# EasyEDA schematic SCH_Tanbre_v2_2026-05-30_new.json
TITLE: Tanbre; REV: 2.0; Date: 2026-05-30; Sheet: 1/1; Company: Student
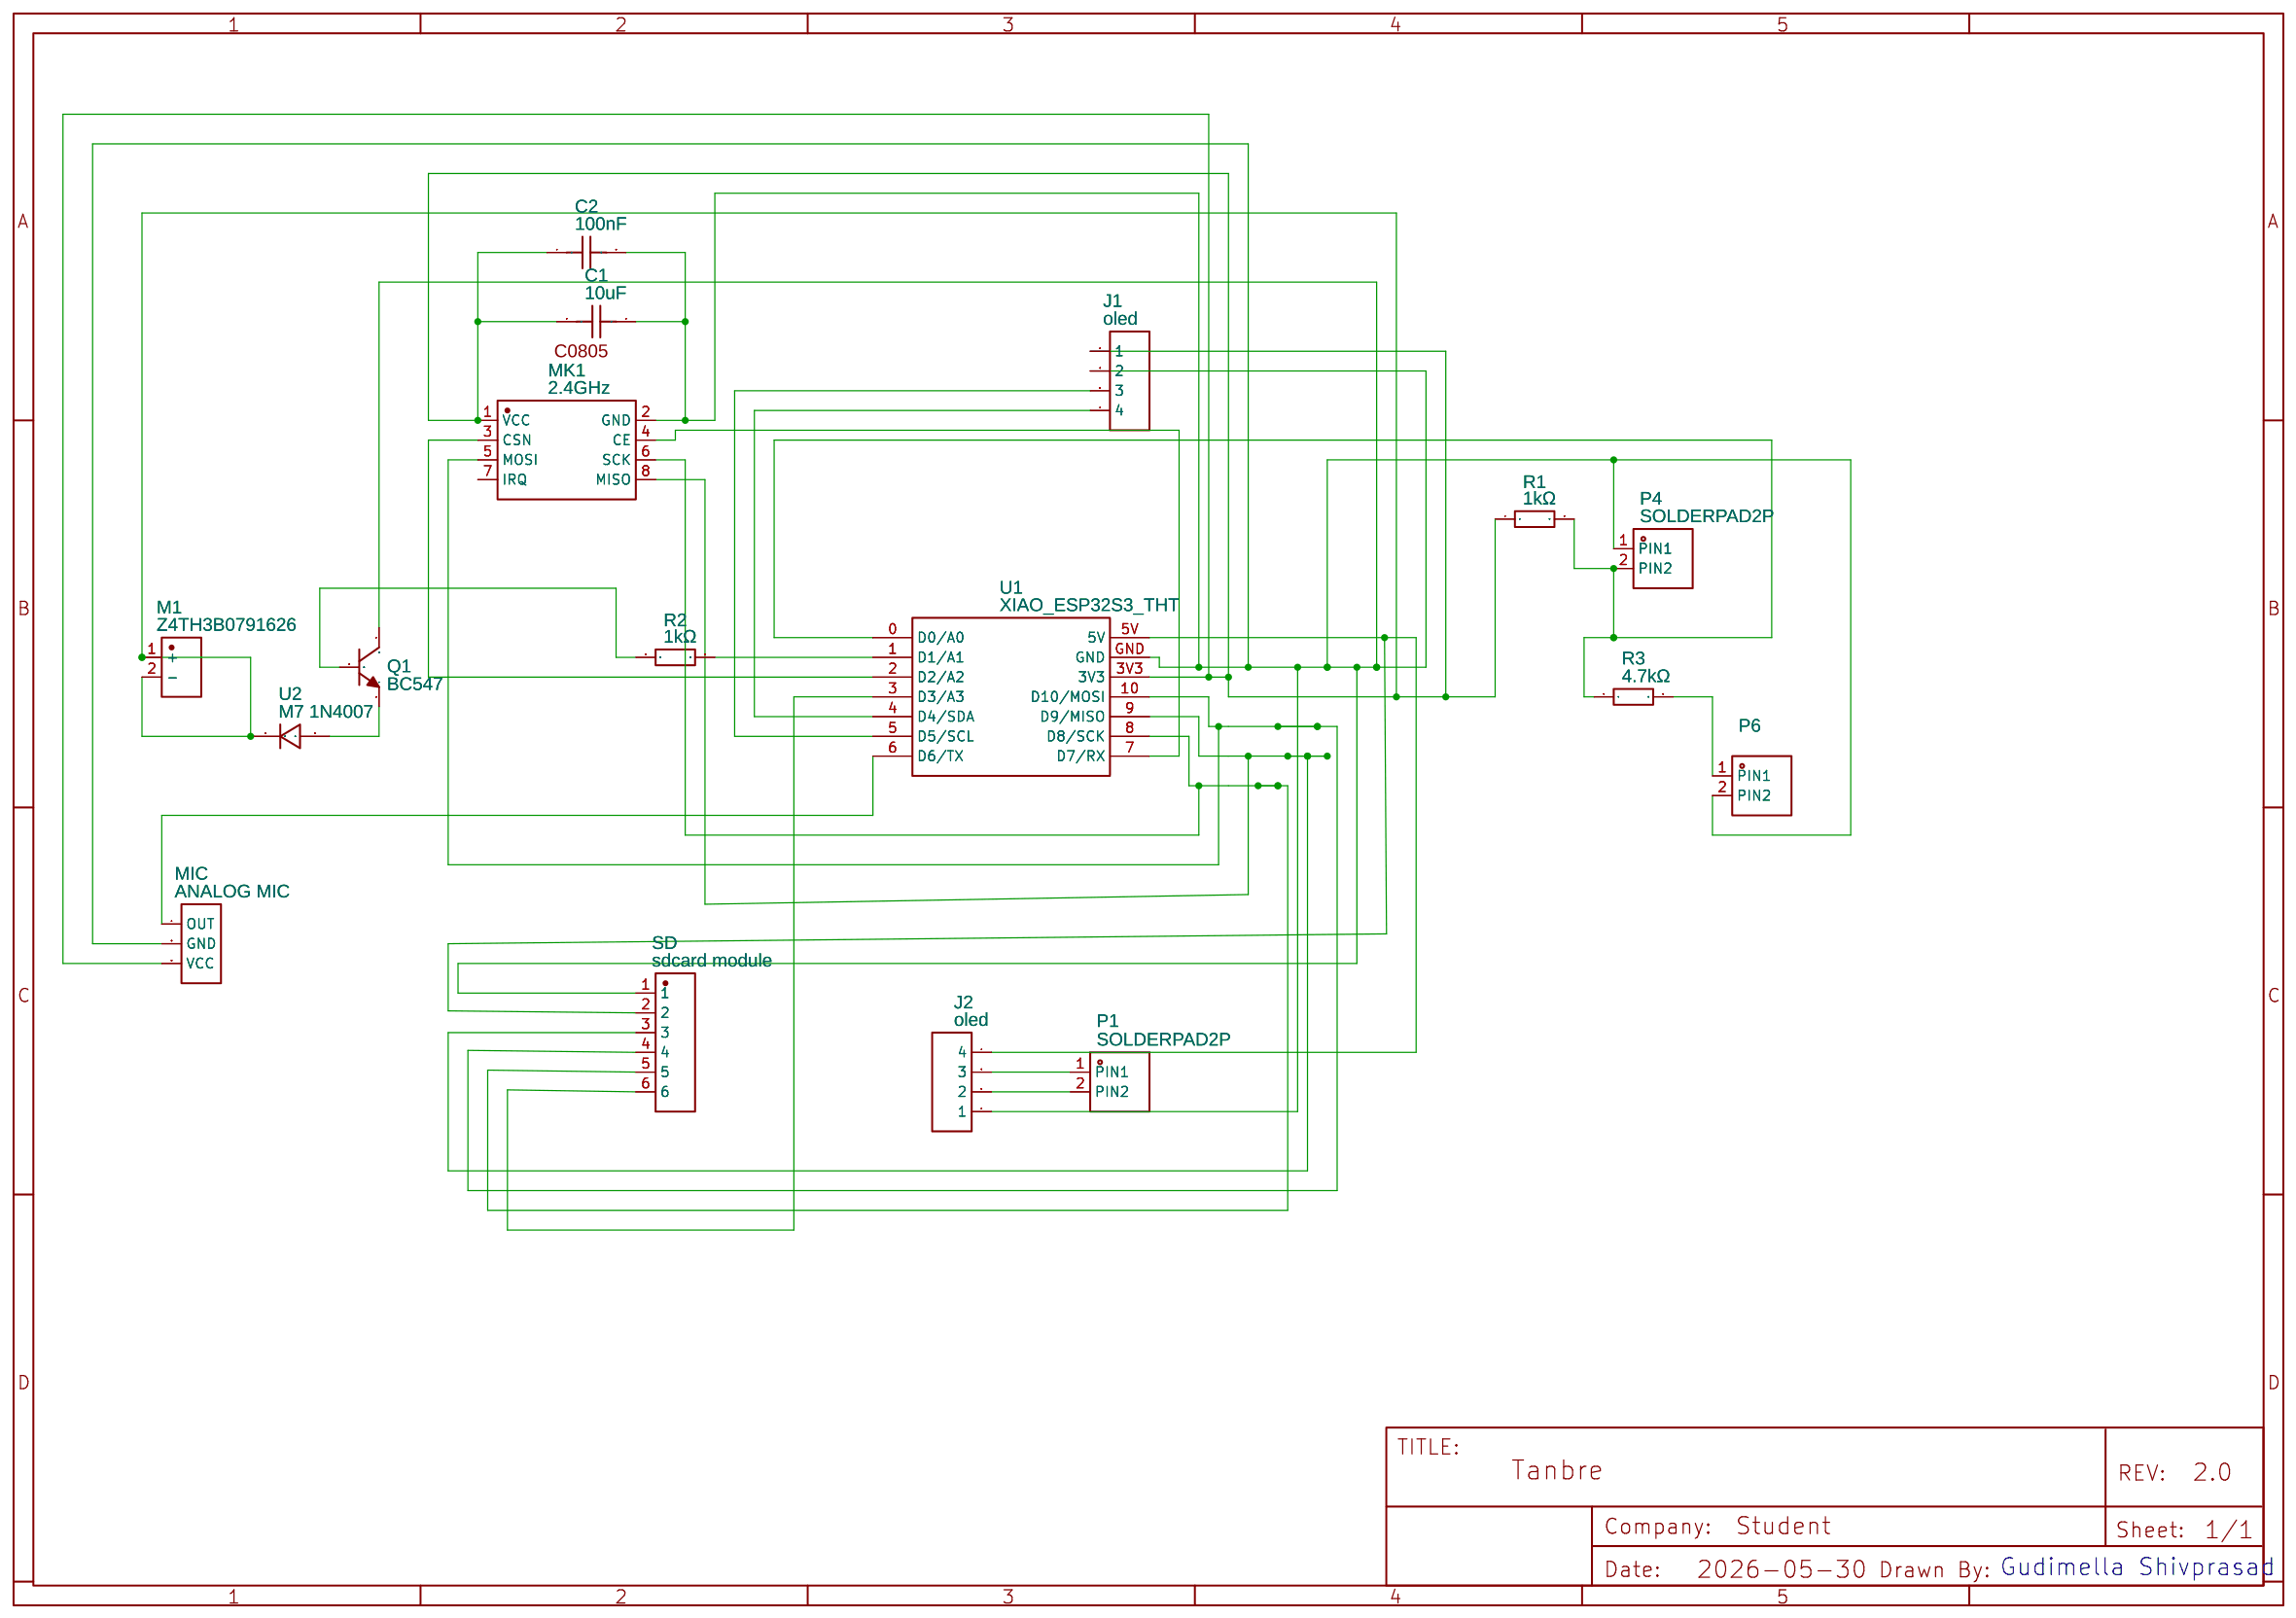
[diagram p0: schematic sheet]

## Parts
C1  10uF  [C0805]
C2  100nF  [C0805]
J1  oled  [HDR-M-2.54_1X4]
J2  oled  [HDR-M-2.54_1X4]
M1  Z4TH3B0791626  [MOTOR-SMD_Z4TH3B0791626]
MIC  ANALOG MIC  [HDR-M-2.54_1X3]
MK1  2.4GHz  [WIRELM-SMD_L28.6-W15.3-P2.54_NRF24L01]
P1  SOLDERPAD2P  [SOLDERPAD-BIG-2X1-2.54MM]
P4  SOLDERPAD2P  [SOLDERPAD-BIG-2X1-2.54MM]
P6  SOLDERPAD2P  [SOLDERPAD-BIG-2X1-2.54MM]
Q1  BC547  [TO-92-3_L4.5-W3.5-P1.27-L]
R1  1kΩ  [R0402]
R2  1kΩ  [R0402]
R3  4.7kΩ  [R1206]
SD  sdcard module  [HDR-TH_HC-PM254-5.0H-1X6PZ]
U1  XIAO_ESP32S3_THT  [XIAO_ESP32S3_THT]
U2  M7 1N4007  [SMA_L4.4-W2.8-LS5.4-RD]

## Library data of the parts
C1 = V106K0805X5R250NHP: Contributor: lcsc; Supplier: LCSC; Supplier Part: C5240379; Manufacturer: VIIYONG(微容); JLCPCB Part Class: Extended Part; Package Display: Yes
C2 = VJ0805Y104KXXCW1BC: Supplier: LCSC; Supplier Part: C2169829; Manufacturer: VISHAY(威世); JLCPCB Part Class: Extended Part; Contributor: lcsc
J1 J2 = HDR-M-2.54_1x4: Supplier Part: C124378; Supplier: LCSC; Contributor: arnotang
M1 = Z4TH3B0791626: Supplier: LCSC; Supplier Part: C2836756; Manufacturer: KOTL(金龙机电); JLCPCB Part Class: Extended Part; Contributor: lcsc
MIC = HDR-M-2.54_1x3: Supplier Part: C124375; Supplier: LCSC; Contributor: arnotang
MK1 = NRF24L01: Supplier: LCSC; Manufacturer: Ai-Thinker(安信可); Manufacturer Part: NF-04; Supplier Part: C90751; JLCPCB Part Class: Extended Part
P1 P4 P6 = SOLDERPAD2P: Manufacturer Part: New SchematicLib; Contributor: bszabo
Q1 = BC547: Contributor: LCSC; Supplier: LCSC; Supplier Part: C2910381; Manufacturer: CJ(江苏长电/长晶); Manufacturer Part: BC547(RANGE:420-800); JLCPCB Part Class: Extended Part
R1 R2 = CR-02JL6----1K: Contributor: LCSC; Supplier: LCSC; Supplier Part: C279987; Manufacturer: Viking(光颉); JLCPCB Part Class: Extended Part
R3 = RMC12064.7K5%N: Contributor: LCSC; Supplier: LCSC; Supplier Part: C269760; Manufacturer: Tyohm(幸亚电阻); JLCPCB Part Class: Extended Part
SD = HC-PM254-5.0H-1X6PZ: Supplier: LCSC; Supplier Part: C27985231; Manufacturer: HC(虹成电子); Manufacturer Part: HC-PM254-5.0H-1x6PZ; JLCPCB Part Class: Extended Part; Contributor: lcsc
U1 = XIAO_ESP32S3_THT: Contributor: maeldefoy
U2 = M7 1N4007: Contributor: lcsc; Supplier: LCSC; Supplier Part: C5337558; Manufacturer: JUXING(钜兴); JLCPCB Part Class: Extended Part

## Nets
Net-(C1-1): C1.1 C2.1 J1.1 M1.1(+) M1.2(-) MIC.3(VCC) MK1.1(VCC) R1.1 U1.3V3 U2.1
Net-(C1-2): C1.2 C2.2 J1.2 J2.1 MIC.2(GND) MK1.2(GND) P4.1(PIN1) P6.2(PIN2) Q1.1(C) SD.1 U1.GND
Net-(J1-3): J1.3 U1.5(D5/SCL)
Net-(J1-4): J1.4 U1.4(D4/SDA)
Net-(J2-2): J2.2 P1.2(PIN2)
Net-(J2-3): J2.3 P1.1(PIN1)
Net-(J2-4): J2.4 SD.2 U1.5V
Net-(MIC-1): MIC.1(OUT) U1.6(D6/TX)
Net-(MK1-3): MK1.3(CSN) U1.2(D2/A2)
Net-(MK1-4): MK1.4(CE) U1.7(D7/RX)
Net-(MK1-5): MK1.5(MOSI) SD.4 U1.10(D10/MOSI)
Net-(MK1-6): MK1.6(SCK) SD.5 U1.8(D8/SCK)
Net-(MK1-8): MK1.8(MISO) SD.3 U1.9(D9/MISO)
Net-(P4-2): P4.2(PIN2) R1.2 R3.1 U1.0(D0/A0)
Net-(P6-1): P6.1(PIN1) R3.2
Net-(Q1-2): Q1.2(B) R2.1
Net-(Q1-3): Q1.3(E) U2.2
Net-(R2-2): R2.2 U1.1(D1/A1)
Net-(SD-6): SD.6 U1.3(D3/A3)

Not connected (* = marked no-connect by the designer): MK1 7(IRQ)

## Notes on the sheet
- Gudimella Shivprasad
